# EAGLE design STM64 (EAGLE 7.2.0)
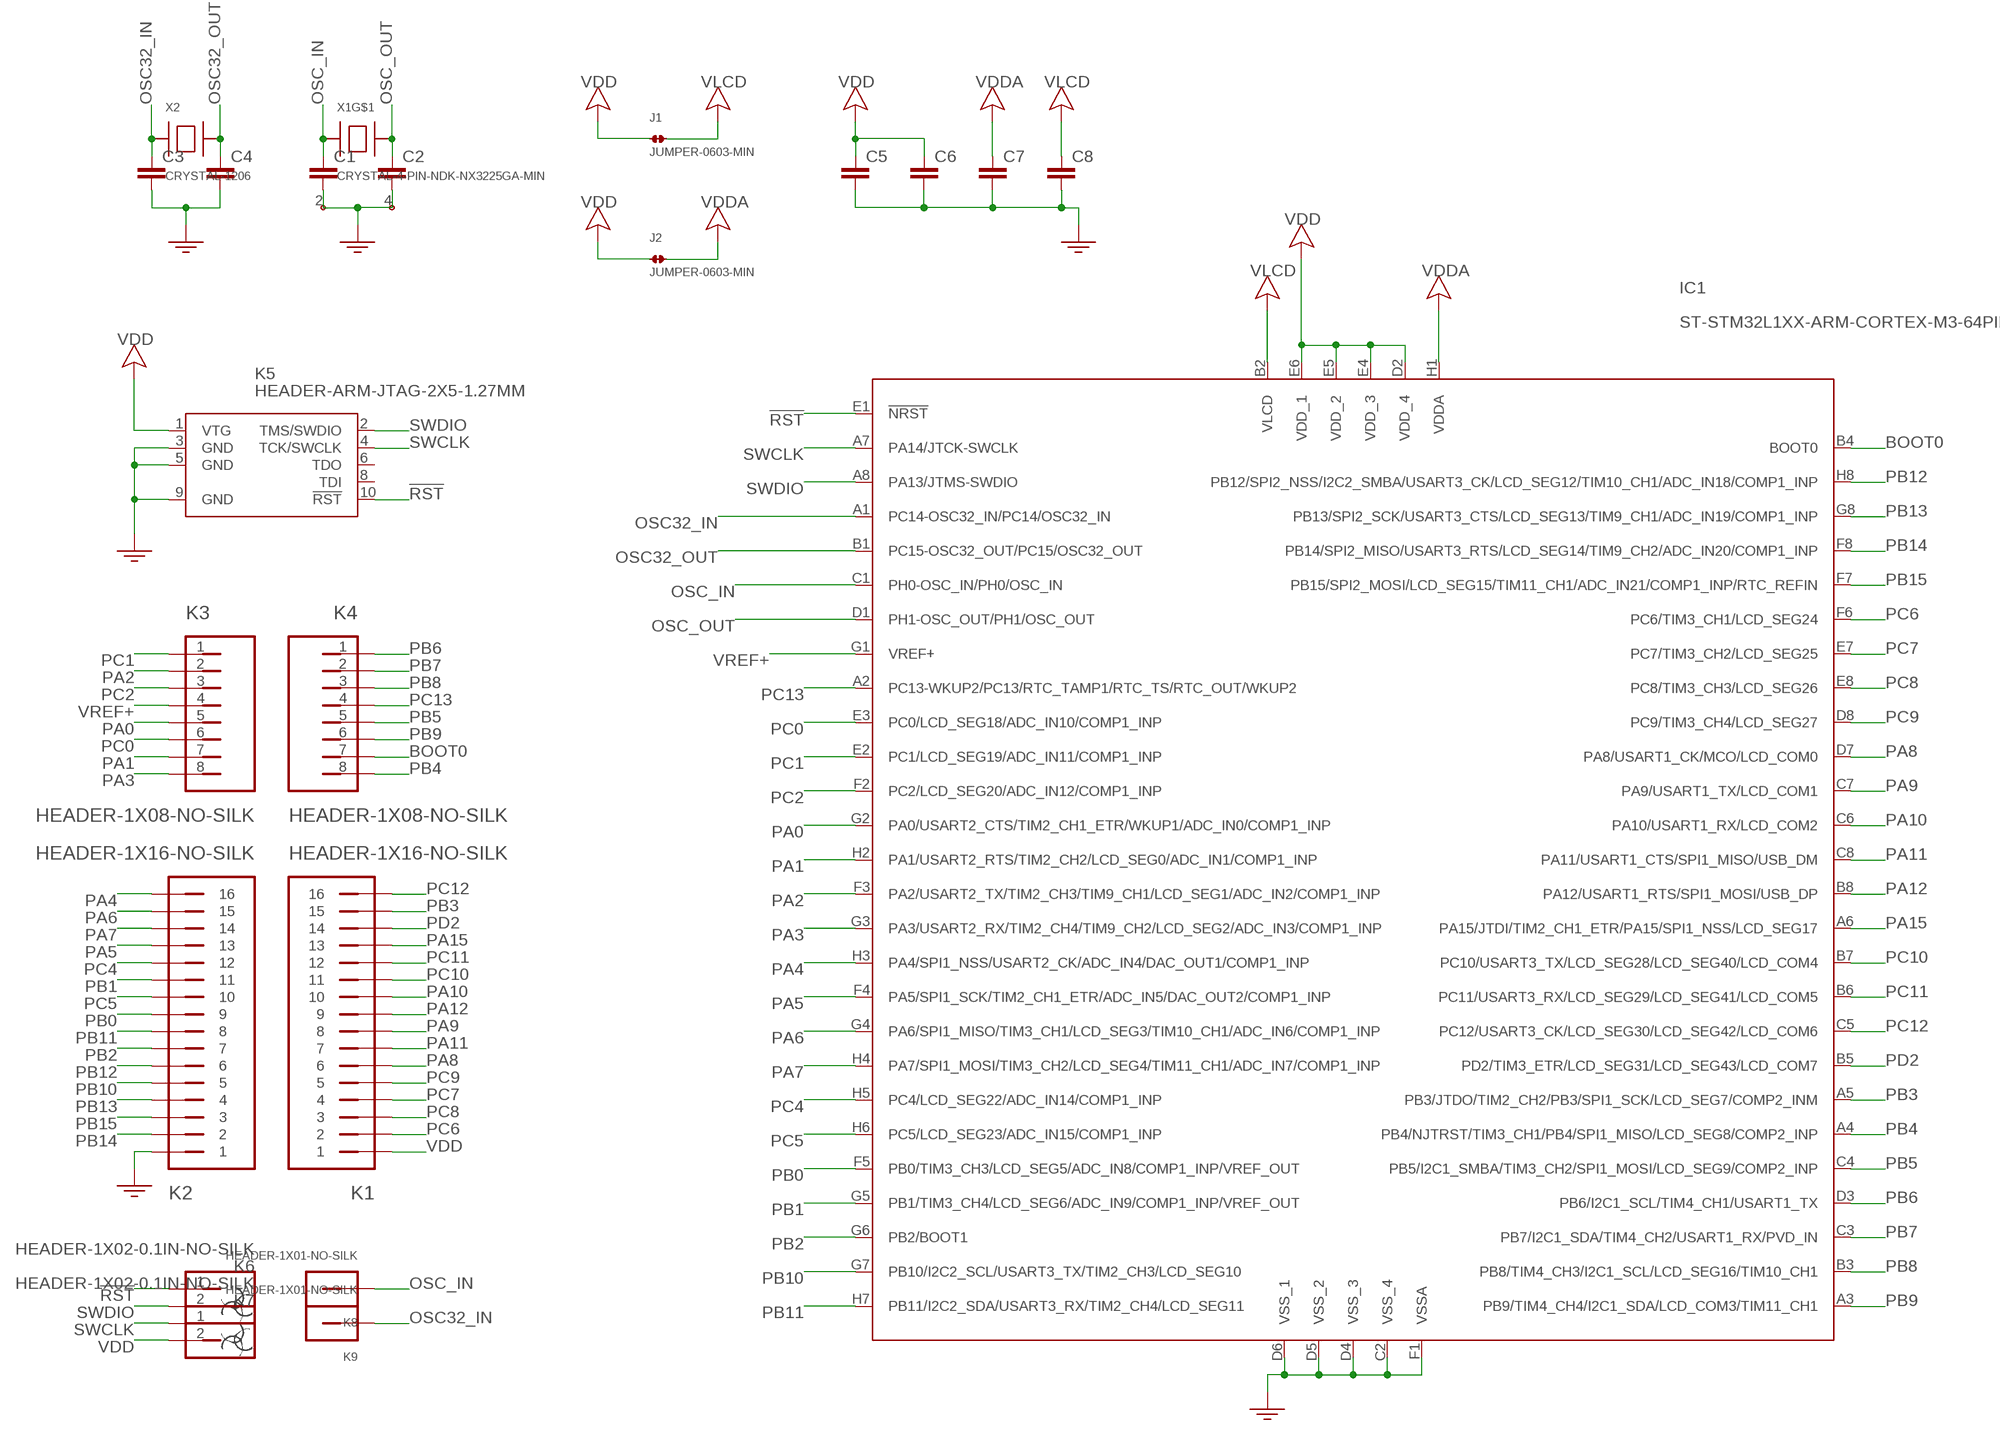
[diagram p0: schematic, sheet 1]

## Parts
C1  CAP-0402-MIN  [0402-MIN]
C2  CAP-0402-MIN  [0402-MIN]
C3  CAP-0402-MIN  [0402-MIN]
C4  CAP-0402-MIN  [0402-MIN]
C5  CAP-0402-MIN  [0402-MIN]
C6  CAP-0402-MIN  [0402-MIN]
C7  CAP-0402-MIN  [0402-MIN]
C8  CAP-0402-MIN  [0402-MIN]
IC1  ST-STM32L1XX-ARM-CORTEX-M3-64PIN  [BGA64-5X5MM-0.5MM]
J1  JUMPER-0603-MIN  [0603-MIN-JUMPER]
J2  JUMPER-0603-MIN  [0603-MIN-JUMPER]
K1  HEADER-1X16-NO-SILK  [HEADER-1X16-NO-SILK]
K2  HEADER-1X16-NO-SILK  [HEADER-1X16-NO-SILK]
K3  HEADER-1X08-NO-SILK  [HEADER-1X08-NO-SILK]
K4  HEADER-1X08-NO-SILK  [HEADER-1X08-NO-SILK]
K5  HEADER-ARM-JTAG-2X5-1.27MM  [HEADER-SMT-1.27MM-5X2-JTAG]
K6  HEADER-1X02-0.1IN-NO-SILK  [HEADER-1X02-NO-SILK]
K7  HEADER-1X02-0.1IN-NO-SILK  [HEADER-1X02-NO-SILK]
K8  HEADER-1X01-NO-SILK  [HEADER-1X01-NO-SILK]
K9  HEADER-1X01-NO-SILK  [HEADER-1X01-NO-SILK]
X1  CRYSTAL-4-PIN-NDK-NX3225GA-MIN  [CRYSTAL-NDK-NX3225GA-3X2.5MM-MIN]
X2  CRYSTAL-1206  [1206-MIN]

## Nets
!RST: IC1.E1(!NRST) K5.10(!RST) K6.1
BOOT0: IC1.B4(BOOT0) K4.7
GND: C1.1 C2.1 C3.1 C4.1 C5.1 C6.1 C7.1 C8.1 IC1.C2(VSS_4) IC1.D4(VSS_3) IC1.D5(VSS_2) IC1.D6(VSS_1) IC1.F1(VSSA) K2.1 K5.3(GND) K5.5(GND) K5.9(GND) X1.2 X1.4
OSC32_IN: C3.2 IC1.A1(PC14-OSC32_IN/PC14/OSC32_IN) K9.1 X2.1
OSC32_OUT: C4.2 IC1.B1(PC15-OSC32_OUT/PC15/OSC32_OUT) X2.2
OSC_IN: C1.2 IC1.C1(PH0-OSC_IN/PH0/OSC_IN) K8.1 X1.1
OSC_OUT: C2.2 IC1.D1(PH1-OSC_OUT/PH1/OSC_OUT) X1.3
PA0: IC1.G2(PA0/USART2_CTS/TIM2_CH1_ETR/WKUP1/ADC_IN0/COMP1_INP) K3.5
PA1: IC1.H2(PA1/USART2_RTS/TIM2_CH2/LCD_SEG0/ADC_IN1/COMP1_INP) K3.7
PA2: IC1.F3(PA2/USART2_TX/TIM2_CH3/TIM9_CH1/LCD_SEG1/ADC_IN2/COMP1_INP) K3.2
PA3: IC1.G3(PA3/USART2_RX/TIM2_CH4/TIM9_CH2/LCD_SEG2/ADC_IN3/COMP1_INP) K3.8
PA4: IC1.H3(PA4/SPI1_NSS/USART2_CK/ADC_IN4/DAC_OUT1/COMP1_INP) K2.16
PA5: IC1.F4(PA5/SPI1_SCK/TIM2_CH1_ETR/ADC_IN5/DAC_OUT2/COMP1_INP) K2.13
PA6: IC1.G4(PA6/SPI1_MISO/TIM3_CH1/LCD_SEG3/TIM10_CH1/ADC_IN6/COMP1_INP) K2.15
PA7: IC1.H4(PA7/SPI1_MOSI/TIM3_CH2/LCD_SEG4/TIM11_CH1/ADC_IN7/COMP1_INP) K2.14
PA8: IC1.D7(PA8/USART1_CK/MCO/LCD_COM0) K1.6
PA9: IC1.C7(PA9/USART1_TX/LCD_COM1) K1.8
PA10: IC1.C6(PA10/USART1_RX/LCD_COM2) K1.10
PA11: IC1.C8(PA11/USART1_CTS/SPI1_MISO/USB_DM) K1.7
PA12: IC1.B8(PA12/USART1_RTS/SPI1_MOSI/USB_DP) K1.9
PA15: IC1.A6(PA15/JTDI/TIM2_CH1_ETR/PA15/SPI1_NSS/LCD_SEG17) K1.13
PB0: IC1.F5(PB0/TIM3_CH3/LCD_SEG5/ADC_IN8/COMP1_INP/VREF_OUT) K2.9
PB1: IC1.G5(PB1/TIM3_CH4/LCD_SEG6/ADC_IN9/COMP1_INP/VREF_OUT) K2.11
PB2: IC1.G6(PB2/BOOT1) K2.7
PB3: IC1.A5(PB3/JTDO/TIM2_CH2/PB3/SPI1_SCK/LCD_SEG7/COMP2_INM) K1.15
PB4: IC1.A4(PB4/NJTRST/TIM3_CH1/PB4/SPI1_MISO/LCD_SEG8/COMP2_INP) K4.8
PB5: IC1.C4(PB5/I2C1_SMBA/TIM3_CH2/SPI1_MOSI/LCD_SEG9/COMP2_INP) K4.5
PB6: IC1.D3(PB6/I2C1_SCL/TIM4_CH1/USART1_TX) K4.1
PB7: IC1.C3(PB7/I2C1_SDA/TIM4_CH2/USART1_RX/PVD_IN) K4.2
PB8: IC1.B3(PB8/TIM4_CH3/I2C1_SCL/LCD_SEG16/TIM10_CH1) K4.3
PB9: IC1.A3(PB9/TIM4_CH4/I2C1_SDA/LCD_COM3/TIM11_CH1) K4.6
PB10: IC1.G7(PB10/I2C2_SCL/USART3_TX/TIM2_CH3/LCD_SEG10) K2.5
PB11: IC1.H7(PB11/I2C2_SDA/USART3_RX/TIM2_CH4/LCD_SEG11) K2.8
PB12: IC1.H8(PB12/SPI2_NSS/I2C2_SMBA/USART3_CK/LCD_SEG12/TIM10_CH1/ADC_IN18/COMP1_INP) K2.6
PB13: IC1.G8(PB13/SPI2_SCK/USART3_CTS/LCD_SEG13/TIM9_CH1/ADC_IN19/COMP1_INP) K2.4
PB14: IC1.F8(PB14/SPI2_MISO/USART3_RTS/LCD_SEG14/TIM9_CH2/ADC_IN20/COMP1_INP) K2.2
PB15: IC1.F7(PB15/SPI2_MOSI/LCD_SEG15/TIM11_CH1/ADC_IN21/COMP1_INP/RTC_REFIN) K2.3
PC0: IC1.E3(PC0/LCD_SEG18/ADC_IN10/COMP1_INP) K3.6
PC1: IC1.E2(PC1/LCD_SEG19/ADC_IN11/COMP1_INP) K3.1
PC2: IC1.F2(PC2/LCD_SEG20/ADC_IN12/COMP1_INP) K3.3
PC4: IC1.H5(PC4/LCD_SEG22/ADC_IN14/COMP1_INP) K2.12
PC5: IC1.H6(PC5/LCD_SEG23/ADC_IN15/COMP1_INP) K2.10
PC6: IC1.F6(PC6/TIM3_CH1/LCD_SEG24) K1.2
PC7: IC1.E7(PC7/TIM3_CH2/LCD_SEG25) K1.4
PC8: IC1.E8(PC8/TIM3_CH3/LCD_SEG26) K1.3
PC9: IC1.D8(PC9/TIM3_CH4/LCD_SEG27) K1.5
PC10: IC1.B7(PC10/USART3_TX/LCD_SEG28/LCD_SEG40/LCD_COM4) K1.11
PC11: IC1.B6(PC11/USART3_RX/LCD_SEG29/LCD_SEG41/LCD_COM5) K1.12
PC12: IC1.C5(PC12/USART3_CK/LCD_SEG30/LCD_SEG42/LCD_COM6) K1.16
PC13: IC1.A2(PC13-WKUP2/PC13/RTC_TAMP1/RTC_TS/RTC_OUT/WKUP2) K4.4
PD2: IC1.B5(PD2/TIM3_ETR/LCD_SEG31/LCD_SEG43/LCD_COM7) K1.14
SWCLK: IC1.A7(PA14/JTCK-SWCLK) K5.4(TCK/SWCLK) K7.1
SWDIO: IC1.A8(PA13/JTMS-SWDIO) K5.2(TMS/SWDIO) K6.2
VDD: C5.2 C6.2 IC1.D2(VDD_4) IC1.E4(VDD_3) IC1.E5(VDD_2) IC1.E6(VDD_1) J1.1 J2.1 K1.1 K5.1(VTG) K7.2 ; supply symbol labelled V
VDDA: C7.2 IC1.H1(VDDA) J2.2 ; supply symbol labelled V
VLCD: C8.2 IC1.B2(VLCD) J1.2 ; supply symbol labelled V
VREF+: IC1.G1(VREF+) K3.4
Unconnected: K5.6(TDO) K5.8(TDI)

## Library data of the parts
C1-C8 = Outbreak:CAP
IC1 = Outbreak:ST-STM32L1XX-ARM-CORTEX-M3-64PIN
J1 J2 = Outbreak:JUMPER
K1 K2 = Outbreak:HEADER-1X16-NO-SILK
K3 K4 = Outbreak:HEADER-1X08-NO-SILK
K5 = Outbreak:HEADER-ARM-JTAG-2X5
K6 K7 = Outbreak:HEADER-1X02
K8 K9 = Outbreak:HEADER-1X01
X1 = Outbreak:CRYSTAL-4-PIN
X2 = Outbreak:CRYSTAL

## Board
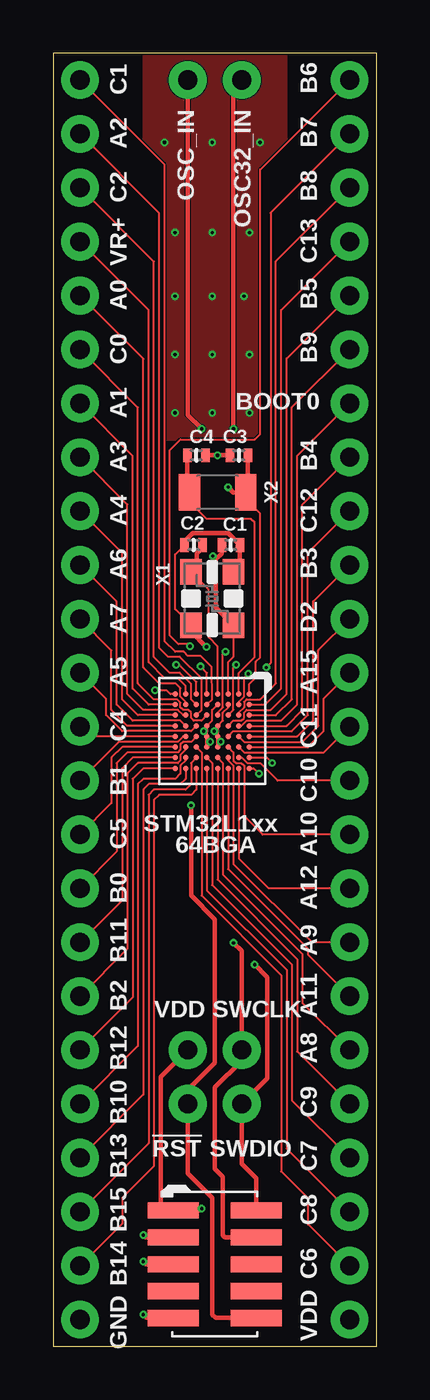
[diagram p1: board, top side]
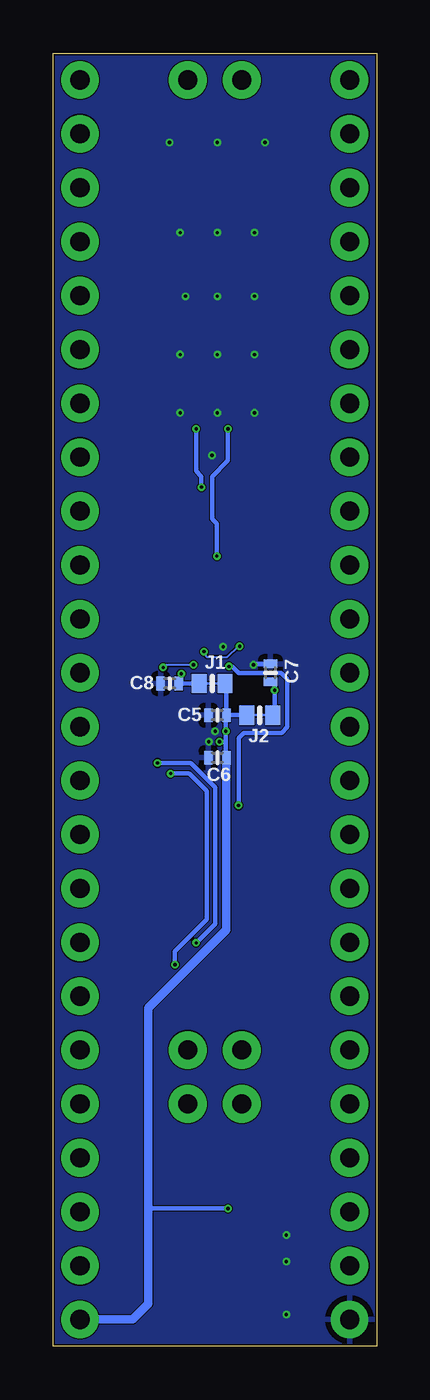
[diagram p2: board, bottom side, seen from below]

Size 15.24 x 60.96 mm. Coordinates in mm from the lower left corner, seen from the top.
Outline: 0,0 15.24,0 15.24,60.96 0,60.96 0,0
Copper layers (1*16): Top 0.035mm / dielectric 1.5mm / Bottom 0.035mm
Design rules "default *": minimum track width 0.1mm, minimum drill 5mil, track to track 0.05mm, track to pad 0.05mm, pad to pad 0.05mm, via to via 0.05mm, smd to smd 0mil, copper to edge 0.1mm, drill to drill 0.2mm, minimum pad ring 0.2mm, minimum via ring 0.1mm, stop-mask expansion 0.05mm, vias tented up to drill 0.5mm, thermal gap 10mil

### Footprints (pad centres in the part's own frame; a part is rotated, then mirrored left to right if it is on the bottom)
0402-MIN = smd 0.4 x 0.65: 1 -0.425,0; 2 0.425,0
BGA64-5X5MM-0.5MM = smd 0.27 x 0.27: A1 -1.75,1.75; A2 -1.25,1.75; A3 -0.75,1.75; A4 -0.25,1.75; A5 0.25,1.75; A6 0.75,1.75; A7 1.25,1.75; A8 1.75,1.75; B1 -1.75,1.25; B2 -1.25,1.25; B3 -0.75,1.25; B4 -0.25,1.25; B5 0.25,1.25; B6 0.75,1.25; B7 1.25,1.25; B8 1.75,1.25; C1 -1.75,0.75; C2 -1.25,0.75; C3 -0.75,0.75; C4 -0.25,0.75; C5 0.25,0.75; C6 0.75,0.75; C7 1.25,0.75; C8 1.75,0.75; D1 -1.75,0.25; D2 -1.25,0.25; D3 -0.75,0.25; D4 -0.25,0.25; D5 0.25,0.25; D6 0.75,0.25; D7 1.25,0.25; D8 1.75,0.25; E1 -1.75,-0.25; E2 -1.25,-0.25; E3 -0.75,-0.25; E4 -0.25,-0.25; E5 0.25,-0.25; E6 0.75,-0.25; E7 1.25,-0.25; E8 1.75,-0.25; F1 -1.75,-0.75; F2 -1.25,-0.75; F3 -0.75,-0.75; F4 -0.25,-0.75; F5 0.25,-0.75; F6 0.75,-0.75; F7 1.25,-0.75; F8 1.75,-0.75; G1 -1.75,-1.25; G2 -1.25,-1.25; G3 -0.75,-1.25; G4 -0.25,-1.25; G5 0.25,-1.25; G6 0.75,-1.25; G7 1.25,-1.25; G8 1.75,-1.25; H1 -1.75,-1.75; H2 -1.25,-1.75; H3 -0.75,-1.75; H4 -0.25,-1.75; H5 0.25,-1.75; H6 0.75,-1.75; H7 1.25,-1.75; H8 1.75,-1.75
0603-MIN-JUMPER = smd 0.7 x 0.9: 1 -0.61,0; 2 0.61,0
HEADER-1X16-NO-SILK = drill 0.9 pad 1.778: 1 -19.05,0; 2 -16.51,0; 3 -13.97,0; 4 -11.43,0; 5 -8.89,0; 6 -6.35,0; 7 -3.81,0; 8 -1.27,0; 9 1.27,0; 10 3.81,0; 11 6.35,0; 12 8.89,0; 13 11.43,0; 14 13.97,0; 15 16.51,0; 16 19.05,0
HEADER-1X08-NO-SILK = drill 0.9 pad 1.778: 1 -8.89,0; 2 -6.35,0; 3 -3.81,0; 4 -1.27,0; 5 1.27,0; 6 3.81,0; 7 6.35,0; 8 8.89,0
HEADER-SMT-1.27MM-5X2-JTAG = smd 0.76 x 2.4: 1 -2.54,-1.95; 2 -2.54,1.95; 3 -1.27,-1.95; 4 -1.27,1.95; 5 0,-1.95; 6 0,1.95; 7 1.27,-1.95; 8 1.27,1.95; 9 2.54,-1.95; 10 2.54,1.95
HEADER-1X02-NO-SILK = drill 0.9 pad 1.778: 1 -1.27,0; 2 1.27,0
HEADER-1X01-NO-SILK = drill 0.9 pad 1.778: 1 0,0
CRYSTAL-NDK-NX3225GA-3X2.5MM-MIN = smd 1.2 x 1: 1 -1.25,-1; 2 1.25,-1; 3 1.25,1; 4 -1.25,1
1206-MIN = smd 1 x 1.727: 1 -1.323,0; 2 1.323,0

### Placement (x,y rotation side)
C1  8.38,37.77 180 top
C2  6.62,37.77 0 top
C3  8.75,42 0 top
C4  6.75,42 180 top
C5  7.5,29.75 0 bottom
C6  7.5,27.75 0 bottom
C7  5,31.75 270 bottom
C8  9.75,31.25 0 bottom
IC1  7.5,29 270 top
J1  7.75,31.25 180 bottom
J2  5.5,29.75 0 bottom
K1  13.97,20.32 90 top
K2  1.27,20.32 90 top
K3  1.27,50.8 270 top
K4  13.97,50.8 270 top
K5  7.62,3.88 270 top
K6  7.62,11.43 0 top
K7  7.62,13.97 180 top
K8  6.35,59.69 0 top
K9  8.89,59.69 0 top
X1  7.5,35.25 90 top
X2  7.75,40.25 180 top

### Tracks (layer width: path | path; a pad name or v marks a point on that pad's centre or on a via)
!RST  (via drill 0.15)
  Top 0.102: IC1.E1 7.25,31.75 v6.95,32.05
  Top 0.203: K5.10 7.66,1.34 7.5,1.5 7.5,7 6.35,8.15 K6.1 6.35,12.1 7.62,13.38 7.62,20.12 6.5,21.25 v6.5,25.5
  Bottom 0.203: v6.95,32.05 6.8,32.05 6.5,31.75 4.5,31.75 4.2,31.45 4.2,29.2 4.47,28.93 6.25,28.93 6.5,28.68 v6.5,25.5
BOOT0
  Top 0.102: IC1.B4 8.88,29.25 9.12,29.5 10.75,29.5 11.5,30.25 11.5,41.98 K4.7
GND  (via drill 0.15)
  Top 0.102: IC1.D4 8,29.5 8,29.88 8.25,30.12 IC1.C2 | v7.6,29 7.75,29 | v7.9,28.5 7.75,28.5 | IC1.F1 6.75,31.32 5.95,32.12 v5.8,32.12 | 8.8,36.8 X1.2 | 6.2,37.95 C2.1 5.75,37.33 5.75,34.75 X1.4 6.5,33.7
  Top 0.152: IC1.D6 7.75,28.5 IC1.D5 7.75,29 IC1.D4
  Top 0.203: 8.8,36.8 C1.1 8.25,38.33 6.58,38.33 6.2,37.95 | C4.1 v7.75,42 C3.1 | v7.22,32.98 6.5,33.7 | K5.9 4.41,1.34 v4.25,1.5 | K5.5 4.37,3.88 v4.25,4 | K5.3 4.35,5.15 v4.25,5.25
  Bottom 0.203: C7.1 5.75,32.17 v5.8,32.12
  other vias: 7.5,44 7.5,46.75 7.5,49.5 7.5,52.5 7.5,56.75 5.25,56.75 9.75,56.75 5.75,46.75 9.25,46.75 9.25,44 5.75,44 5.75,52.5 5.75,49.5 9,49.5 9.25,52.5
  pour Bottom: 0,61 0,0 15.25,0 15.25,61
  pour Top: 4.25,61 4.25,42.75 11,42.75 11,61
OSC32_IN  (via drill 0.15)
  Top 0.102: IC1.A1 9.25,31.23 9.55,31.52 9.55,32.27 9.75,32.48 9.75,39.25 9.07,39.93 X2.1 9.18,40.35
  Top 0.203: 9.18,40.35 C3.2 | X2.1 8.5,40.25 v8.25,40.5 | v8.5,43.25 8.5,59.3 K9.1
  Bottom 0.203: v8.25,40.5 8.25,41 8.5,41.25 v8.5,43.25
OSC32_OUT
  Top 0.102: IC1.B1 8.75,31.75 9.5,32.5 9.5,38.82 9.32,39 7.25,39 6.43,39.82 X2.2 6.33,40.35
  Top 0.203: 6.33,40.35 C4.2
OSC_IN  (via drill 0.15)
  Top 0.102: IC1.C1 8.25,32.25 8.5,32.5 X1.1
  Top 0.203: X1.1 7.67,34.83 7.67,37.1 | C1.2 7.95,37.38 7.67,37.1 | 7.67,37.1 v7.53,37.25 | K8.1 6.35,43.9 v7,43.25
  Bottom 0.203: v7.53,37.25 7.53,38.77 7.75,39 7.75,41 7,41.75 v7,43.25
OSC_OUT
  Top 0.102: IC1.D1 7.75,33 7.33,33.42 7.33,35.67 X1.3 6.78,36.77 | C2.2 7.05,37.65
  Top 0.203: 7.05,37.65 6.78,37.38 6.78,36.77
PA0
  Top 0.102: IC1.G2 6.25,30.38 6,30.62 6,31.02 5.78,31.25 5,31.25 4.25,32 4.25,46.55 K3.5
PA1
  Top 0.102: IC1.H2 4.5,30.25 3.75,31 3.75,41.97 K3.7
PA2
  Top 0.102: IC1.F3 7,30 7,31.48 5.97,32.5 5.42,32.5 5,32.92 5,53.42 K3.2
PA3
  Top 0.102: IC1.G3 6.12,29.75 5.88,30 4.25,30 3.5,30.75 3.5,39.68 K3.8
PA4
  Top 0.102: IC1.H3 4,29.75 3.25,30.5 3.25,37.39 K2.16
PA5
  Top 0.102: IC1.F4 6.5,29 3.25,29 2.5,29.75 2.5,30.52 K2.13
PA6
  Top 0.102: IC1.G4 6,29.5 3.75,29.5 3,30.25 3,35.1 K2.15
PA7
  Top 0.102: IC1.H4 3.5,29.25 2.75,30 2.75,32.81 K2.14
PA8
  Top 0.102: IC1.D7 8,27.5 8,22.25 11.75,18.5 11.75,16.19 K1.6
PA9
  Top 0.102: IC1.C7 8.25,27.62 8.5,27.38 8.5,22.75 12.2,19.05 K1.8
PA10
  Top 0.102: IC1.C6 8.5,28 8.5,27.62 8.62,27.5 8.88,27.5 9,27.38 9,25 9.87,24.13 K1.10
PA11
  Top 0.102: IC1.C8 8.25,22.5 12,18.75 12,18.48 K1.7
PA12
  Top 0.102: IC1.B8 8.75,23 10.16,21.59 K1.9
PA15
  Top 0.102: IC1.A6 12,28.25 12.75,29 12.75,30.53 K1.13
PB0
  Top 0.102: IC1.F5 6.5,28.5 6.12,28.5 6,28.38 6,28.12 5.88,28 3.5,28 3,27.5 3,23.32 K2.9
PB1
  Top 0.102: IC1.G5 6.12,28.75 5.88,28.5 3.1,28.5 K2.11
PB2
  Top 0.102: IC1.G6 6.25,28.12 6,27.88 6,27.62 5.88,27.5 4,27.5 3.5,27 3.5,18.74 K2.7
PB3
  Top 0.102: IC1.A5 11.5,28.75 12.25,29.5 12.25,35.11 K1.15
PB4
  Top 0.102: IC1.A4 11,29.25 11.75,30 11.75,39.69 K4.8
PB5
  Top 0.102: IC1.C4 8.5,29.5 8.88,29.5 9,29.62 9,29.88 9.12,30 10.25,30 11,30.75 11,46.56 K4.5
PB6  (via drill 0.15)
  Top 0.102: IC1.D3 7.75,29.88 8,30.12 8,32.62 v8.12,32.75 | v6.45,33 6.35,33.1 5.9,33.1 5.5,33.5 5.5,42.25 6,42.75 9.5,42.75 9.75,43 9.75,55.47 K4.1
  Bottom 0.102: v8.12,32.75 8.12,32.62 8,32.5 7.03,32.5 6.53,33 v6.45,33
PB7  (via drill 0.15)
  Top 0.102: IC1.C3 8.5,30 8.5,32 v8.62,32.12 | K4.2 10.25,53.43 10.25,32.2 v10.05,32
  Bottom 0.102: v8.62,32.12 9.93,32.12 v10.05,32
PB8
  Top 0.102: IC1.B3 8.75,29.88 9,30.12 9,30.38 9.12,30.5 9.75,30.5 10.5,31.25 10.5,51.14 K4.3
PB9
  Top 0.102: IC1.A3 10.5,29.75 11.25,30.5 11.25,44.27 K4.6
PB10
  Top 0.102: IC1.G7 6.25,27.62 6,27.38 6,27 5.75,26.75 4.25,26.75 4,26.5 4,14.16 K2.5
PB11
  Top 0.102: IC1.H7 3.75,27.75 3.25,27.25 3.25,21.03 K2.8
PB12
  Top 0.102: IC1.H8 4.25,27.25 3.75,26.75 3.75,16.45 K2.6
PB13
  Top 0.102: IC1.G8 6.25,26.75 6,26.5 4.5,26.5 4.25,26.25 4.25,11.87 K2.4
PB14
  Top 0.102: IC1.F8 6.75,26.25 6.5,26 5,26 4.75,25.75 4.75,8.5 3.25,7 3.25,5.79 K2.2
PB15
  Top 0.102: IC1.F7 6.5,27.5 6.5,26.5 6.25,26.25 4.75,26.25 4.5,26 4.5,9.58 K2.3
PC0
  Top 0.102: IC1.E3 7,29.5 6.62,29.5 6.5,29.62 6.5,29.88 6.38,30 6.12,30 6,30.12 6,30.35 5.85,30.5 4.75,30.5 4,31.25 4,44.26 K3.6
PC1
  Top 0.102: IC1.E2 7.5,30.5 7.47,32.02 6.95,32.55 6.35,32.55 6.15,32.75 5.75,32.75 5.25,33.25 5.25,55.71 K3.1
PC2
  Top 0.102: IC1.F2 6.5,30.5 6.5,31.23 5.97,31.75 5.5,31.75 4.75,32.5 4.75,51.13 K3.3
PC4
  Top 0.102: IC1.H5 1.73,28.75 K2.12
PC5
  Top 0.102: IC1.H6 3.25,28.25 2.75,27.75 2.75,25.61 K2.10
PC6
  Top 0.102: IC1.F6 7,28 7,21.25 10.75,17.5 10.75,8.25 12,7 12,5.75 12.03,5.75 K1.2
PC7
  Top 0.102: IC1.E7 7.5,27.5 7.5,21.75 11.25,18 11.25,11.61 K1.4
PC8
  Top 0.102: IC1.E8 7.25,21.5 11,17.75 11,9.32 K1.3
PC9
  Top 0.102: IC1.D8 7.75,22 11.5,18.25 11.5,13.9 K1.5
PC10
  Top 0.102: IC1.B7 8.9,27.75 9.15,27.5 9.75,27.5 10.58,26.67 K1.11
PC11
  Top 0.102: IC1.B6 9,28 12.76,28 K1.12
PC12
  Top 0.102: IC1.C5 8.5,29 11.25,29 12,29.75 12,37.4 K1.16
PC13
  Top 0.102: IC1.A2 10,30.25 10.75,31 10.75,48.85 K4.4
PD2
  Top 0.102: IC1.B5 9,28.5 11.75,28.5 12.5,29.25 12.5,32.82 K1.14
SWCLK  (via drill 0.15)
  Top 0.102: IC1.A7 10.07,27.75 v10.32,27.5
  Top 0.203: K5.4 8.1,5.15 8,5.25 8,8 7.62,8.38 7.62,12.21 8.89,13.47 K7.1 8.89,18.64 v8.5,19.02
  Bottom 0.203: v8.5,19.02 7.6,19.93 7.6,26.35 8.75,27.5 v10.32,27.5
SWDIO  (via drill 0.15)
  Top 0.102: IC1.A8 9.45,27.25 v9.7,27
  Top 0.203: K5.2 9.57,7.93 8.89,8.61 K6.2 10.1,12.64 10.1,17.4 v9.5,18
  Bottom 0.203: v9.5,18 9.5,18.62 8,20.12 8,26.18 8.82,27 v9.7,27
VDD  (via drill 0.15)
  Top 0.102: IC1.E4 7.5,29.5 7.5,30 IC1.D2 | v7.4,28.5 7.25,28.5 | v7.1,29 7.25,29
  Top 0.152: IC1.E6 7.25,28.5 IC1.E5 7.25,29 IC1.E4
  Top 0.203: v7,6.5 7,6.42 K5.1 5.08,6.42 5.08,12.7 K7.2
  Bottom 0.203: C5.2 7.1,29.73 v7.1,29 7.1,28.5 | C6.2 7.1,27.77 7.1,28.5 | v7.4,28.5 7.1,28.5 | J2.1 C5.2 | J1.1 7.08,31.18 C5.2 | 10.75,6.5 v7,6.5
  Bottom 0.406: K1.1 11.48,1.27 10.75,2 10.75,6.5 10.75,15.95 7.08,19.62 C6.2
VDDA  (via drill 0.15)
  Top 0.102: IC1.H1 5.53,30.75 5.35,30.93 v4.8,30.93
  Bottom 0.203: C7.2 4.8,31.12 v4.8,30.93 4.8,29.84 J2.2
VLCD  (via drill 0.15)
  Top 0.102: IC1.B2 8.75,30.38 9,30.62 9,31.5 v9.2,31.7
  Bottom 0.203: J1.2 C8.2 9.2,31.38 v9.2,31.7
VREF+
  Top 0.102: IC1.G1 6.25,31.12 5.88,31.5 5.25,31.5 4.5,32.25 4.5,48.84 K3.4

### Text on the board
tPlace: C1 | B6 | A2 | OSC_IN | OSC32_IN | B7 | C2 | B8 | VR+ | C13 | A0 | B5 | C0 | B9 | A1 | BOOT0 | A3 | B4 | A4 | A6 | C12 | B3 | A7 | D2 | A5 | A15 | C4 | C11 | B1 | C10 | C5 | STM32L1xx | 64BGA | A10 | B0 | A12 | B11 | A9 | B2 | VDD | SWCLK | B12 | A11 | B10 | A8 | C9 | B13 | !RST | SWDIO | C7 | B15 | C8 | B14 | C6 | GND | VDD